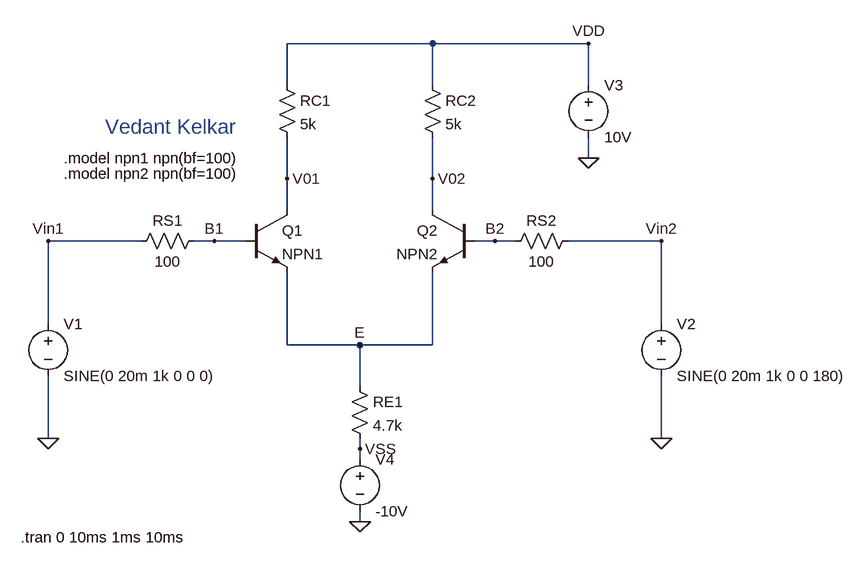
[diagram p0: schematic ECAD_exp9.asc]
ECAD_exp9.asc, the LTspice schematic file:
Version 4
SHEET 1 880 680
WIRE 208 -224 -16 -224
WIRE 448 -224 208 -224
WIRE -16 -160 -16 -224
WIRE 208 -160 208 -224
WIRE 448 -160 448 -224
WIRE 448 -48 448 -80
WIRE -16 -16 -16 -80
WIRE 208 -16 208 -80
WIRE -16 32 -16 -16
WIRE 208 32 208 -16
WIRE -240 80 -384 80
WIRE -128 80 -160 80
WIRE -80 80 -128 80
WIRE 304 80 272 80
WIRE 336 80 304 80
WIRE 560 80 416 80
WIRE -384 208 -384 80
WIRE 560 208 560 80
WIRE -16 240 -16 128
WIRE 96 240 -16 240
WIRE 208 240 208 128
WIRE 208 240 96 240
WIRE 96 304 96 240
WIRE -384 384 -384 288
WIRE 560 384 560 288
WIRE 96 400 96 384
WIRE 96 416 96 400
WIRE 96 512 96 496
FLAG -384 384 0
FLAG -128 80 B1
FLAG -16 -16 V01
FLAG 560 384 0
FLAG 304 80 B2
FLAG 208 -16 V02
FLAG 96 240 E
FLAG 448 -48 0
FLAG 96 512 0
FLAG 448 -224 VDD
FLAG 96 400 VSS
FLAG -384 80 Vin1
FLAG 560 80 Vin2
SYMBOL voltage -384 192 R0
WINDOW 123 0 0 Left 0
WINDOW 39 0 0 Left 0
SYMATTR InstName V1
SYMATTR Value SINE(0 20m 1k 0 0 0)
SYMBOL res -144 64 R90
WINDOW 0 0 56 VBottom 2
WINDOW 3 32 56 VTop 2
SYMATTR InstName RS1
SYMATTR Value 100
SYMBOL npn -80 32 R0
SYMATTR InstName Q1
SYMATTR Value NPN1
SYMBOL res -32 -176 R0
SYMATTR InstName RC1
SYMATTR Value 5k
SYMBOL voltage 560 192 R0
WINDOW 123 0 0 Left 0
WINDOW 39 0 0 Left 0
SYMATTR InstName V2
SYMATTR Value SINE(0 20m 1k 0 0 180)
SYMBOL res 432 64 R90
WINDOW 0 0 56 VBottom 2
WINDOW 3 32 56 VTop 2
SYMATTR InstName RS2
SYMATTR Value 100
SYMBOL npn 272 32 M0
SYMATTR InstName Q2
SYMATTR Value NPN2
SYMBOL res 192 -176 R0
SYMATTR InstName RC2
SYMATTR Value 5k
SYMBOL res 80 288 R0
SYMATTR InstName RE1
SYMATTR Value 4.7k
SYMBOL voltage 448 -176 R0
WINDOW 123 0 0 Left 0
WINDOW 39 0 0 Left 0
SYMATTR InstName V3
SYMATTR Value 10V
SYMBOL voltage 96 400 R0
WINDOW 123 0 0 Left 0
WINDOW 39 0 0 Left 0
SYMATTR InstName V4
SYMATTR Value -10V
TEXT -360 -48 Left 2 !.model npn1 npn(bf=100)
TEXT -360 -24 Left 2 !.model npn2 npn(bf=100)
TEXT -426 536 Left 2 !.tran 0 10ms 1ms 10ms
TEXT -296 -96 Left 3 ;Vedant Kelkar

The netlist it stands for:
* ECAD_exp9.asc
V1 Vin1 0 SINE(0 20m 1k 0 0 0)
RS1 B1 Vin1 100
Q1 V01 B1 E 0 NPN1
RC1 VDD V01 5k
V2 Vin2 0 SINE(0 20m 1k 0 0 180)
RS2 Vin2 B2 100
Q2 V02 B2 E 0 NPN2
RC2 VDD V02 5k
RE1 E VSS 4.7k
V3 VDD 0 10V
V4 VSS 0 -10V
.model NPN NPN
.model PNP PNP
.lib standard.bjt
.model npn1 npn(bf=100)
.model npn2 npn(bf=100)
.tran 0 10ms 1ms 10ms
* Vedant Kelkar
.backanno
.end